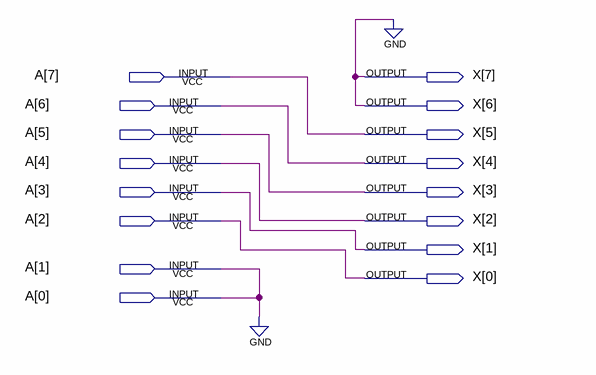
[diagram p0: schematic sheet]
// Quartus schematic CORR2.bdf as structural Verilog: 0 symbols, 16 pins
module CORR2 (
  input  [7:0] A,
  output [7:0] X
);


  assign A[0] = A[1];
  assign X = {2'b00, A[7:2]};
  // also tied to GND on the sheet: A[1]
endmodule
